# Altium schematic sheet LM399_Test_board.SchDoc
size 420 x 297 mm; SheetNumber: 1; SheetTotal: 1
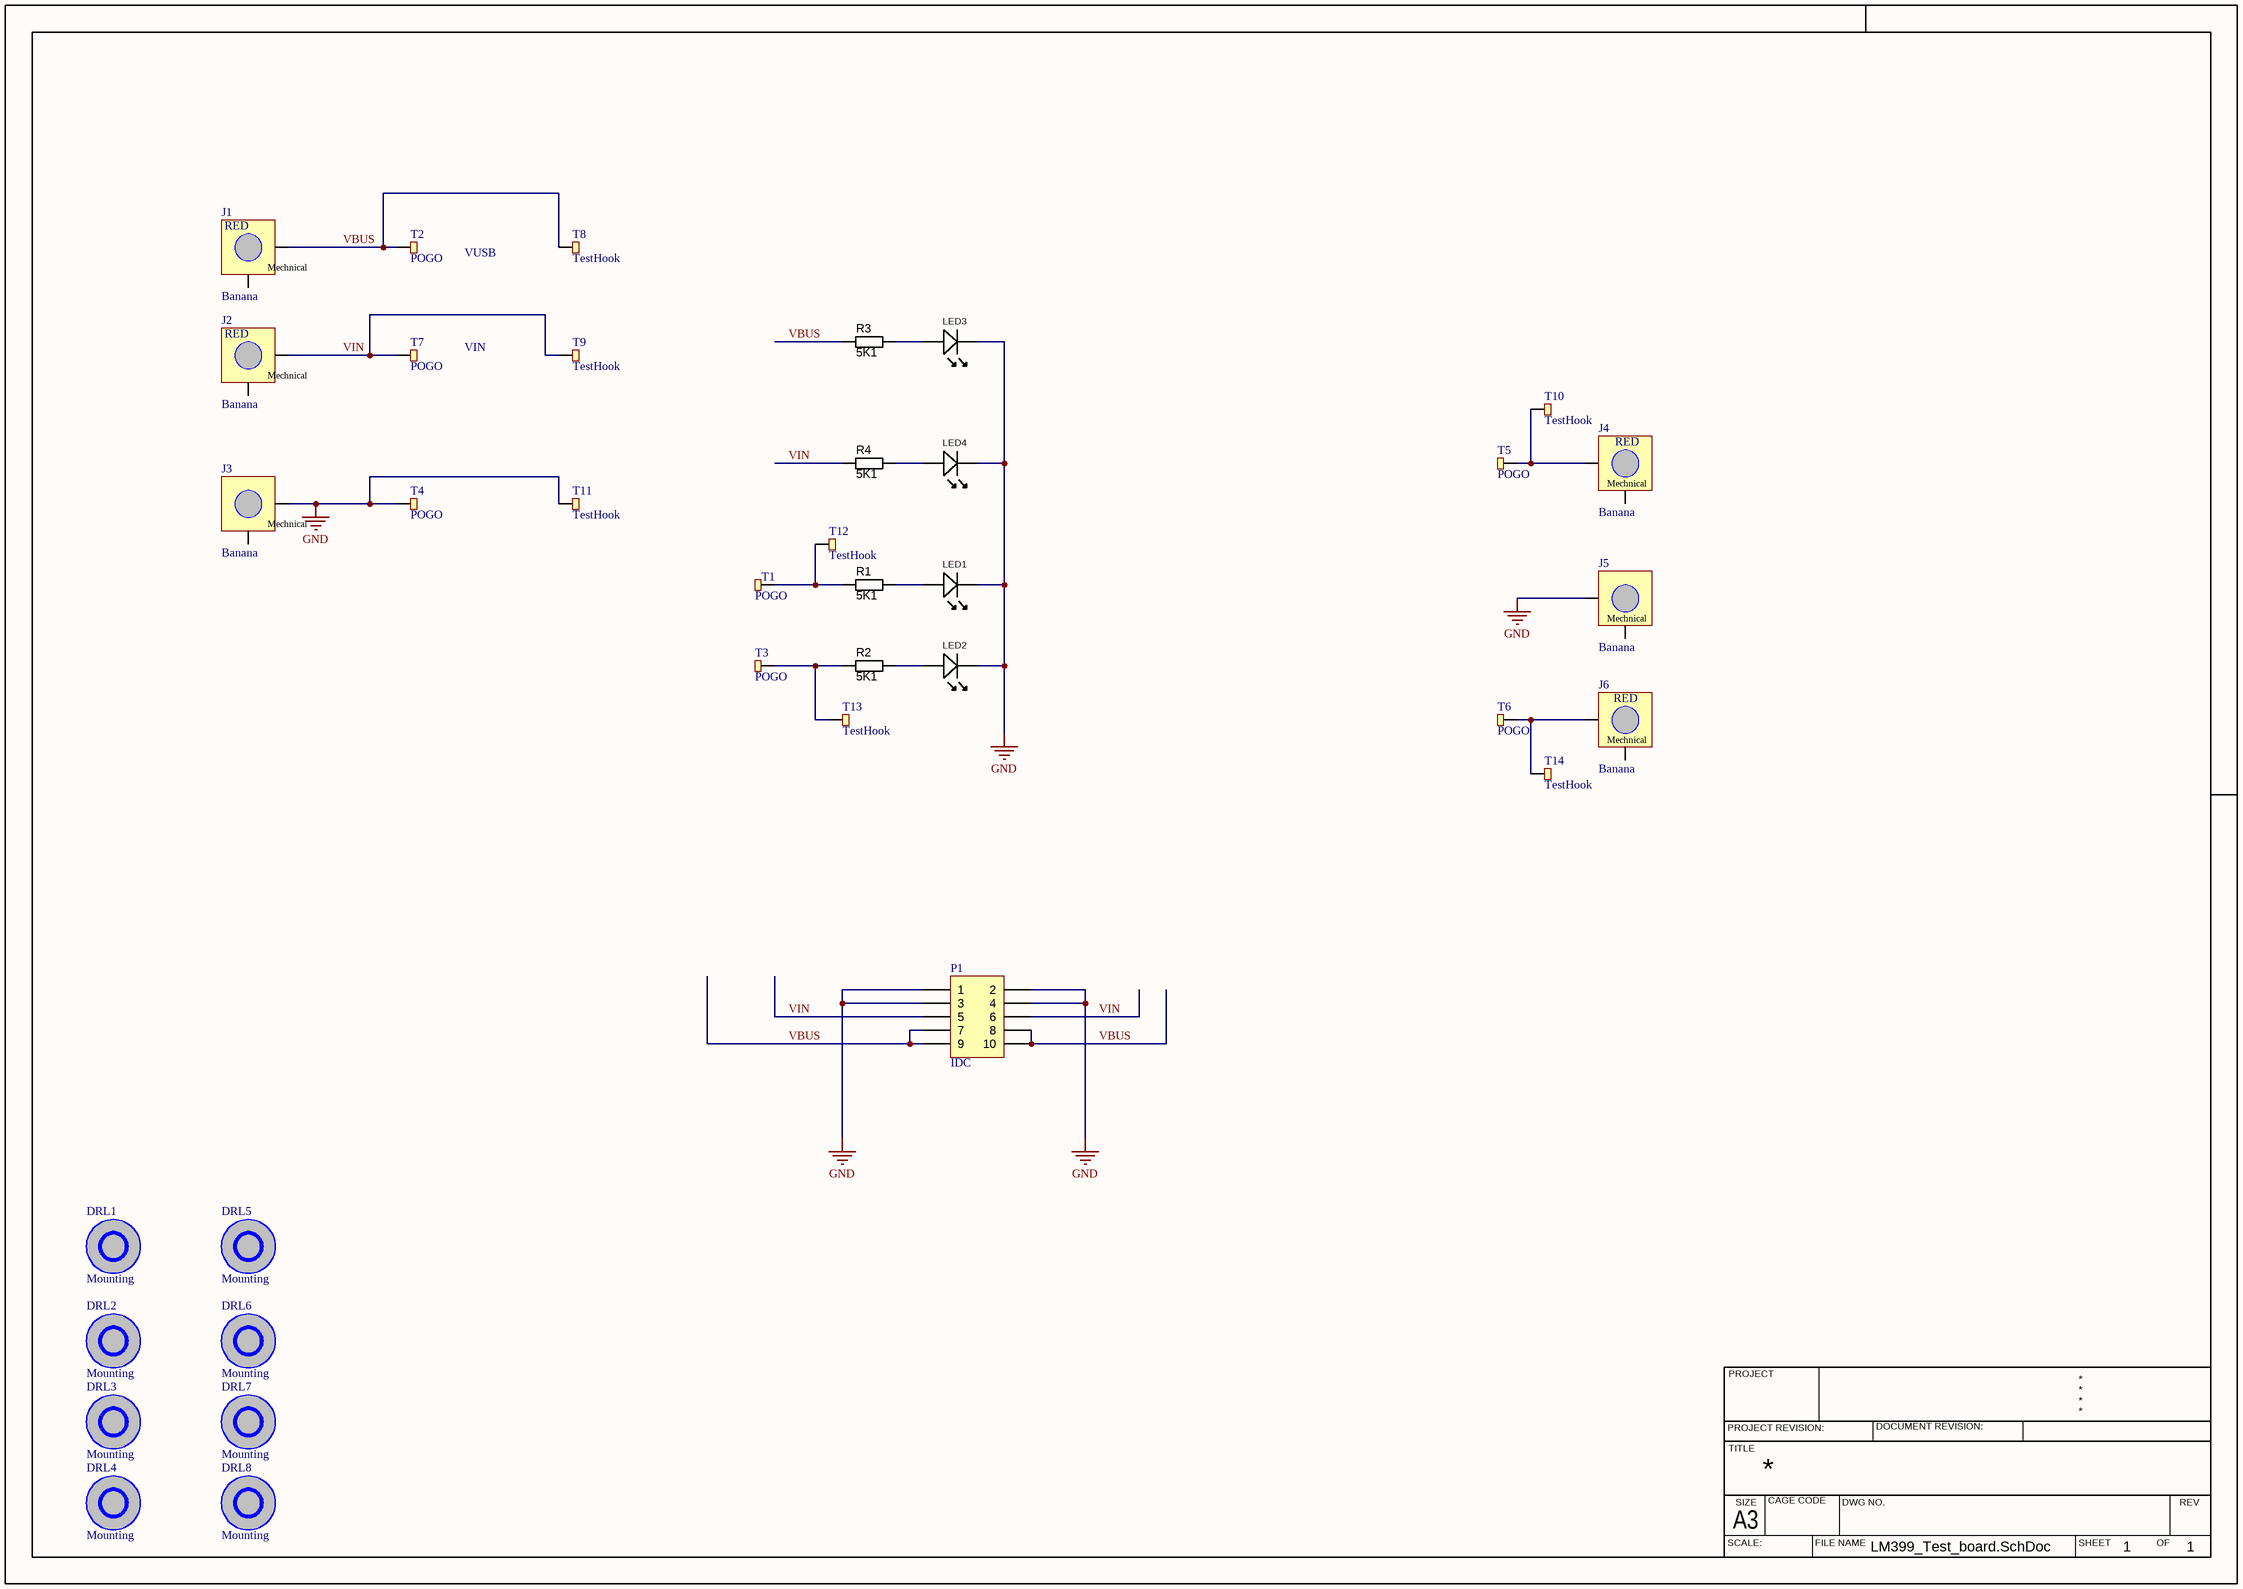
[diagram p0: LM399_Test_board.SchDoc]

## Parts
DRL1  Mounting  [NO_COPPER_NOMASK_2m75_6m2]
DRL2  Mounting  [NO_COPPER_NOMASK_2m75_6m2]
DRL3  Mounting  [NO_COPPER_NOMASK_2m75_6m2]
DRL4  Mounting  [NO_COPPER_NOMASK_2m75_6m2]
DRL5  Mounting  [NO_COPPER_NOMASK_2m75_6m2]
DRL6  Mounting  [NO_COPPER_NOMASK_2m75_6m2]
DRL7  Mounting  [NO_COPPER_NOMASK_2m75_6m2]
DRL8  Mounting  [NO_COPPER_NOMASK_2m75_6m2]
J1  Banana  [Banana_66.9040-22_RED]
J2  Banana  [Banana_66.9040-22_RED]
J3  Banana  [Banana_66.9040-21_BLACK]
J4  Banana  [Banana_66.9040-22_RED]
J5  Banana  [Banana_66.9040-21_BLACK]
J6  Banana  [Banana_66.9040-22_RED]
LED1  (no value)  [LED-0805-K]
LED2  (no value)  [LED-0805-K]
LED3  (no value)  [LED-0805-K]
LED4  (no value)  [LED-0805-K]
P1  IDC  [HDR2X5]
R1  value 5K1  [RESC1608N]  (hidden comment: RES_NL_0603)
R2  value 5K1  [RESC1608N]  (hidden comment: RES_NL_0603)
R3  value 5K1  [RESC1608N]  (hidden comment: RES_NL_0603)
R4  value 5K1  [RESC1608N]  (hidden comment: RES_NL_0603)
T1  POGO  [POGO_0851-0-15-20-82-14-11-0]
T2  POGO  [POGO_0851-0-15-20-82-14-11-0]
T3  POGO  [POGO_0851-0-15-20-82-14-11-0]
T4  POGO  [POGO_0851-0-15-20-82-14-11-0]
T5  POGO  [POGO_0851-0-15-20-82-14-11-0]
T6  POGO  [POGO_0851-0-15-20-82-14-11-0]
T7  POGO  [POGO_0851-0-15-20-82-14-11-0]
T8  TestHook  [1502-x]
T9  TestHook  [1502-x]
T10  TestHook  [1502-x]
T11  TestHook  [1502-x]
T12  TestHook  [1502-x]
T13  TestHook  [1502-x]
T14  TestHook  [1502-x]

## Nets
GND: J3.1 J5.1 LED1.K LED2.K LED3.K LED4.K P1.1 P1.2 P1.3 P1.4 T4.1(TP) T11.1(TP)
VBUS: J1.1 P1.7 P1.8 P1.9 P1.10 R3.1 T2.1(TP) T8.1(TP)
VIN: J2.1 P1.5 P1.6 R4.1 T7.1(TP) T9.1(TP)
NetJ4_1: J4.1 T5.1(TP) T10.1(TP)
NetJ6_1: J6.1 T6.1(TP) T14.1(TP)
NetLED1_A: LED1.A R1.2
NetLED2_A: LED2.A R2.2
NetLED3_A: LED3.A R3.2
NetLED4_A: LED4.A R4.2
NetR1_1: R1.1 T1.1(TP) T12.1(TP)
NetR2_1: R2.1 T3.1(TP) T13.1(TP)

Not connected (* = marked no-connect by the designer): J1 2; J2 2; J3 2; J4 2; J5 2; J6 2

## Notes on the sheet
- (near J1) RED
- VUSB
- (near J2) RED
- VIN
- (near J4) RED
- (near J6) RED
- PROJECT
- PROJECT REVISION:
- TITLE
- DOCUMENT REVISION:
- SCALE:
- A3
- SIZE
- CAGE CODE
- FILE NAME
- DWG NO.
- SHEET
- OF
- REV
- (in symbol Banana) Mechnical

## Library data of the parts
DRL1-DRL8 = Mountinghole: Mounting Hole
LED1-LED4 = LED_SMD_Green_0805: LED, 0805 SMD, Green; Manufacturer 1: Ligitek; Manufacturer Part Number 1: LG170G-CT; Material: GaP; Ratings: 10 mcd; 573 nm; Package / Case: 0805
P1 = Header 5X2: Header, 5-Pin, Dual row; Part: 69830010LF; LatestRevisionDate: 17-Jul-2002; LatestRevisionNote: Re-released for DXP Platform.; Publisher: Altium Limited
R1-R4 = RES_NL_0603: Resistor, SMD chip; Manufacturer 1: Royal Ohm; Ratings: 1/10 W; Tolerance: ±5%; Package / Case: 0603 (1608 metric)
T1-T7 = TestHook